# Altium schematic sheet Nano.SchDoc: ARDUINO NANO
size A4; SheetNumber: 1; SheetTotal: 1
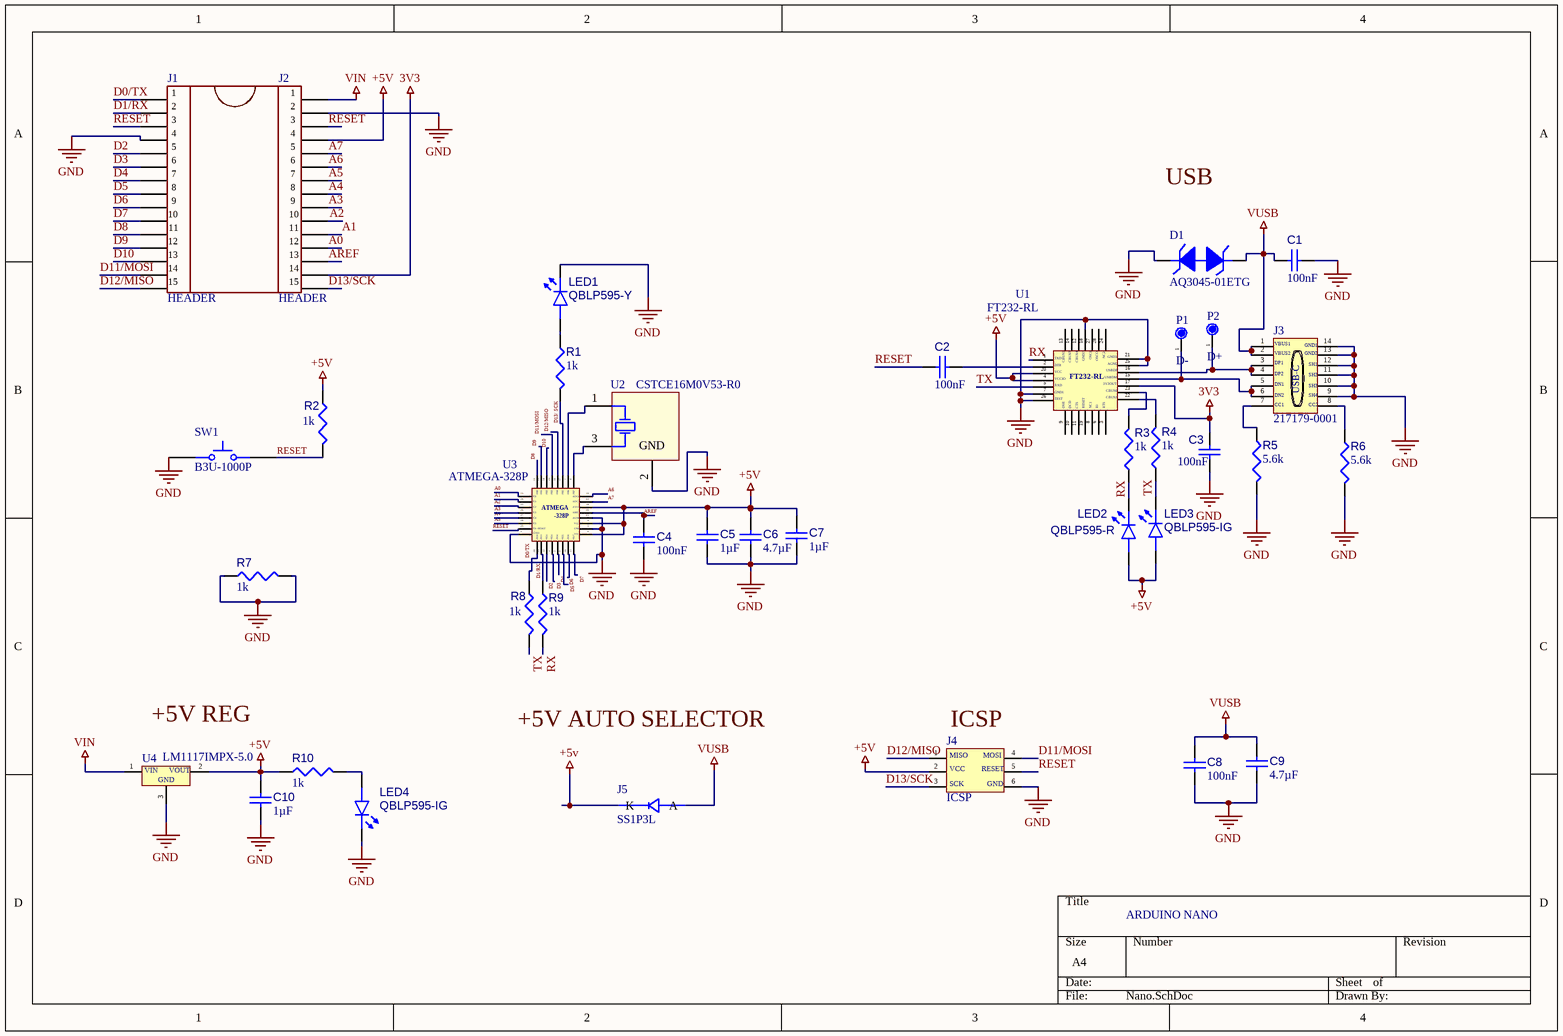
[diagram p0: Nano.SchDoc]

## Parts
C1  value 100nF  [CAPC0402(1005)60_L]  (hidden comment: Capacitor 100nF +/-20% 50V 0402)
C2  value 100nF  [CAPC0402(1005)60_L]  (hidden comment: Capacitor 100nF +/-20% 50V 0402)
C3  value 100nF  [CAPC0402(1005)60_L]  (hidden comment: Capacitor 100nF +/-20% 50V 0402)
C4  value 100nF  [CAPC0402(1005)60_L]  (hidden comment: Capacitor 100nF +/-20% 50V 0402)
C5  value 1µF  [CAPC0603(1608)100_L]  (hidden comment: Capacitor 1µF +/-40% 50V 0603)
C6  value 4.7µF  [CAPC0805(2012)145_L]  (hidden comment: Capacitor 4.7µF +/-40% 25V 0805)
C7  value 1µF  [CAPC0603(1608)100_L]  (hidden comment: Capacitor 1µF +/-40% 50V 0603)
C8  value 100nF  [CAPC0402(1005)60_L]  (hidden comment: Capacitor 100nF +/-20% 50V 0402)
C9  value 4.7µF  [CAPC0805(2012)145_L]  (hidden comment: Capacitor 4.7µF +/-40% 25V 0805)
C10  value 1µF  [CAPC0603(1608)100_L]  (hidden comment: Capacitor 1µF +/-40% 50V 0603)
D1  AQ3045-01ETG  [AQ3045-01ETG]
J1  HEADER  [HEADER]
J2  HEADER  [HEADER]
J3  217179-0001  [2171790001]
J4  ICSP  [ICSP]
J5  SS1P3L  [SS1P3L]
LED1  QBLP595-Y  [QTB-QBLP595_V]
LED2  QBLP595-R  [QTB-QBLP595_V]
LED3  QBLP595-IG  [QTB-QBLP595_V]
LED4  QBLP595-IG  [QTB-QBLP595_V]
P1  D-  [TEST POINT]
P2  D+  [TEST POINT]
R1  value 1k  [RESC0805(2012)_L]  (hidden comment: 1KR5J)
R2  value 1k  [RESC0805(2012)_L]  (hidden comment: 1KR5J)
R3  value 1k  [RESC0805(2012)_L]  (hidden comment: 1KR5J)
R4  value 1k  [RESC0805(2012)_L]  (hidden comment: 1KR5J)
R5  value 5.6k  [RESC0402(1005)_L]  (hidden comment: Resistor 5K6  +/-5 % 0402 63 mW)
R6  value 5.6k  [RESC0402(1005)_L]  (hidden comment: Resistor 5K6  +/-5 % 0402 63 mW)
R7  value 1k  [RESC0805(2012)_L]  (hidden comment: 1KR5J)
R8  value 1k  [RESC0805(2012)_L]  (hidden comment: 1KR5J)
R9  value 1k  [RESC0805(2012)_L]  (hidden comment: 1KR5J)
R10  value 1k  [RESC0805(2012)_L]  (hidden comment: 1KR5J)
SW1  B3U-1000P  [OMRON-B3U-1000_V]
U1  FT232-RL  [FT232-RL]
U2  CSTCE16M0V53-R0  [MURA-CSTCE_V-3_V]
U3  ATMEGA-328P  [ATMEGA-328P]
U4  LM1117IMPX-5.0  [LM1117IMPX-5.0]

## Nets
3V3: C3.1 J2.14 U1.17
+5V: C5.1 C6.1 C7.1 C10.1 J2.4 J4.2 J5.K LED2.2(A) LED3.2(A) R2.1 R10.1 U1.4 U1.20 U3.4 U3.6 U3.18 U4.2
GND: C1.2 C3.2 C4.2 C5.2 C6.2 C7.2 C8.2 C9.2 C10.2 D1.1 J1.4 J2.2 J3.9 J3.10 J3.11 J3.12 J3.13 J3.14 J4.6 LED1.1(K) LED4.1(K) R5.2 R6.2 R7.1 R7.2 SW1.1 U1.7 U1.18 U1.21 U1.25 U1.26 U2.2(GND) U3.3 U3.5 U3.21 U4.3
VIN: J2.1 U4.1
VUSB: C1.1 C8.1 C9.1 D1.0 J3.1 J3.2 J5.A
A0: J2.12 U3.23
A1: J2.11 U3.24
A2: J2.10 U3.25
A3: J2.9 U3.26
A4: J2.8 U3.27
A5: J2.7 U3.28
A6: J2.6 U3.19
A7: J2.5 U3.22
AREF: C4.1 J2.13 U3.20
D0/TX: J1.1 R8.1 U3.30
D1/RX: J1.2 R9.1 U3.31
D2: J1.5 U3.32
D3: J1.6 U3.1
D4: J1.7 U3.2
D5: J1.8 U3.9
D6: J1.9 U3.10
D7: J1.10 U3.11
D8: J1.11 U3.12
D9: J1.12 U3.13
D10: J1.13 U3.14
D11/MOSI: J1.14 J4.4 U3.15
D12/MISO: J1.15 J4.1 U3.16
D13/ SCK: R1.2 U3.17
D13/SCK: J2.15 J4.3
RESET: C2.1 J1.3 J2.3 J4.5 R2.2 SW1.2 U3.29
RX: LED2.1(K) R3.1 R9.2 U1.1
TX: LED3.1(K) R4.1 R8.2 U1.5
NetC2_2: C2.2 U1.2
NetJ3_3: J3.3 J3.4 P2.1 U1.16
NetJ3_5: J3.5 J3.6 P1.1 U1.15
NetJ3_7: J3.7 R5.1
NetJ3_8: J3.8 R6.1
NetLED1_2: LED1.2(A) R1.1
NetLED4_2: LED4.2(A) R10.2
NetR3_2: R3.2 U1.23
NetR4_2: R4.2 U1.22
NetU2_1: U2.1(C1) U3.7
NetU2_3: U2.3(C2) U3.8

Not connected (* = marked no-connect by the designer): U1 3(5) 6(5) 8(5) 9(5) 10(5) 11(5) 12(5) 13(5) 14(5) 19(5) 24(5) 27(5) 28(5)

## Notes on the sheet
- USB
- (near U4) +5V REG
- +5V AUTO SELECTOR
- (near J4) ICSP
- (in symbol ATMEGA-328P) PC0; PB0; PB1; PB2; PB3; PB4; PB5; PB6; ADC6; PB7; PC1; PC2; ADC7; AVCC; PC3; ATMEGA; AREF; PC4; -328P; AGND; PC5; VCC; PC6 / RESET; GND; PD0; PD1; PD2; PD3; PD4; PD5; PD6; PD7
- (in symbol FT232-RL) NC2; TXD; CBUS2; CBUS3; CBUS4; GND2; OSCI; OSCO; GND3; DTR; AGND; VCC; USBDP; VCCIO; USBDM; RXD; 3V3OUT; GND1; CBUS0; TEST; CBUS1; DSR; DCD; CTS; RESET; NC1; RI; RTS
- (in symbol ICSP) MISO; MOSI; VCC; RESET; SCK; GND
- (in symbol LM111IMPX-5.0) VIN; VOUT; GND
- (in symbol USB - C) VBUS1; GND1; VBUS2; GND2; DP1; SH1; DP2; SH2; DN1; SH3; DN2; USB-C; SH4; CC1; CC2

## Library data of the parts
C1-C4 C8 = CMP-001-00067-3: Chip Capacitor, 100nF +/-20%, 50V, 0402, Thickness 0.6 mm; Tolerance: 10%; Min Operating Temperature: -55°C; Pins: 2; Case/Package: 0402; Max Operating Temperature: 85°C; Voltage Rating: 50V; Mounting Technology: SMT
C5 C7 C10 = CMP-001-00078-4: Chip Capacitor, 1µF +/-40%, 50V, 0603, Thickness 1 mm; Tolerance: 10%; Case/Package: 0603; Pins: 2; Max Operating Temperature: 85°C; Voltage Rating: 50V; Mounting Technology: SMT; Min Operating Temperature: -55°C
C6 C9 = CMP-001-00080-4: Chip Capacitor, 4.7µF +/-40%, 25V, 0805, Thickness 1.45 mm; Tolerance: 20%; Voltage Rating: 25V; Min Operating Temperature: -55°C; Max Operating Temperature: 85°C; Pins: 2; Mounting Technology: SMT; Case/Package: 0805
D1 = AQ3045-01ETG: Bi 30Kv 5V 0.35Pf Automotve Tvs Sod882/ T&r Rohs Compliant: Yes |Littelfuse AQ3045-01ETG
J1 J2 = HEADER: Header Pins placements
J3 = USB - C: USB Connector, USB Type C, USB 2.0, Receptacle, 16 Ways, Surface Mount, Through Hole Mount
J5 = SS1P3L: Diode Schottky 30 V 1.5A Surface Mount DO-220AA (SMP); MF: Vishay Semiconductor; SnapEDA_Link: https://www.snapeda.com/parts/SS1P3L/Vishay/view-part/?ref=snap; Package: MicroSMP Vishay General Semiconductor - Diodes Division; Value: *; MP: SS1P3L; Check_prices: https://www.snapeda.com/parts/SS1P3L/Vishay/view-part/?ref=eda
LED1 = CMP-007-00043-3: Chip LED 0402, Yellow, 0.02 A, 3.1 to 3.7 V, -40 to 80 degC, 2-Pin SMD, RoHS, Tape and Reel; Mounting Technology: SMT; Case/Package: 0402; RoHS Compliant: Yes; Pins: 2; Colour: Yellow
LED2 = CMP-007-00040-3: Chip LED 0402, Red, 0.02 A, 2.0 to 2.5 V, -40 to 80 degC, 2-Pin SMD, RoHS, Tape and Reel; Colour: Red; RoHS Compliant: Yes; Case/Package: 0402; Pins: 2; Mounting Technology: SMT
LED3 LED4 = CMP-007-00041-3: Chip LED 0402, Green, 0.02 A, 3.1 to 3.7 V, -40 to 80 degC, 2-Pin SMD, RoHS, Tape and Reel; Case/Package: 0402; Colour: Green; Mounting Technology: SMT; Pins: 2; RoHS Compliant: Yes
P1 P2 = TEST POINT
R1-R4 R7-R10 = CMP-009-00076-2: 1K 0.125W 5% 0805 (2012 Metric)  SMD; Power: 125mW; Pins: 2; Mounting Technology: SMT; Tolerance: 5%; Case/Package: 0805
R5 R6 = CMP-009-00136-3: Chip Resistor, 5,6 kOhms, +/-5 %, 63 mW, -55 to 155 degC, 0402; Power: 63mW; Tolerance: 5%; Max Operating Temperature: 155°C; Case/Package: 0402; Min Operating Temperature: -55°C; Pins: 2
SW1 = CMP-011-00000-2: Tactile Switch, SPST-NO, 0.05 A, 12 V, -25 to 70 degC, 2-Pin SMD, RoHS, Tape and Reel; Manufacturer: Omron Electronic Components; IP Rating: IP40; Current Rating: 50mA; Max Contact Resistance: 100mohm; Operating Force: 153gf; Throw Configuration: SPST; Resistance: 0.1Ohm; Max Voltage Rating (DC): 12V; Contact Material: Silver; Max Current Rating: 50mA; Datasheet URL: http://www.omron.com/ecb/products/pdf/en-b3u.pdf; Mounting Technology: SM; Case/Package: B3U-1000; Packaging: TapeandReel; Package Reference: B3U-1000; Manufacturer URL: http://www.omron.com/; Datasheet Version: Jan-15; RoHS Compliant: True; Max Operating Temperature: 70°C; Contact Current Rating: 50mA; Package Quantity: 3500; Package Description: 2-Pin Surface Mount Device, Body 3 x 2.5 mm; Voltage Rating (DC): 12V; Min Operating Temperature: -25°C; Voltage Rating: 12V
U1 = FT232-RL: USB Bridge, USB to UART USB 2.0 UART Interface 28-SSOP
U2 = CMP-003-00023-3: Ceramic Resonator, 16 MHz, +/- 0.5%, 15 pF, -20 to 80 degC, 3-Pin SMD, RoHS, Tape and Reel; Manufacturer: Murata; Load Capacitance: 15pF; Impedance: 40Ohm; Frequency: 16MHz; Package Reference: CSTCE_V-3; Packaging: TapeandReel; Pins: 3; Manufacturer URL: http://www.murata.com/; RoHS Compliant: True; Package Quantity: 3000; Datasheet Version: Rev. P16E, 12/2015; Max Operating Temperature: 80°C; Self Resonant Frequency: 16MHz; Tolerance: 0.5%; Frequency Tolerance: 0.5%; Case/Package: CSMD; Datasheet URL: http://www.murata.com/products/catalog/pdf/p16e.pdf; Min Operating Temperature: -20°C
U3 = ATMEGA-328P: AVR AVR® ATmega, Functional Safety (FuSa) Microcontroller IC 8-Bit 20MHz 32KB (16K x 16) FLASH 32-TQFP (7x7)
U4 = LM111IMPX-5.0: Linear Voltage Regulator IC Positive Fixed 1 Output 800mA SOT-223-4